# EAGLE design 612_jetracer_esp32c3_030000 (EAGLE 9.6.2)
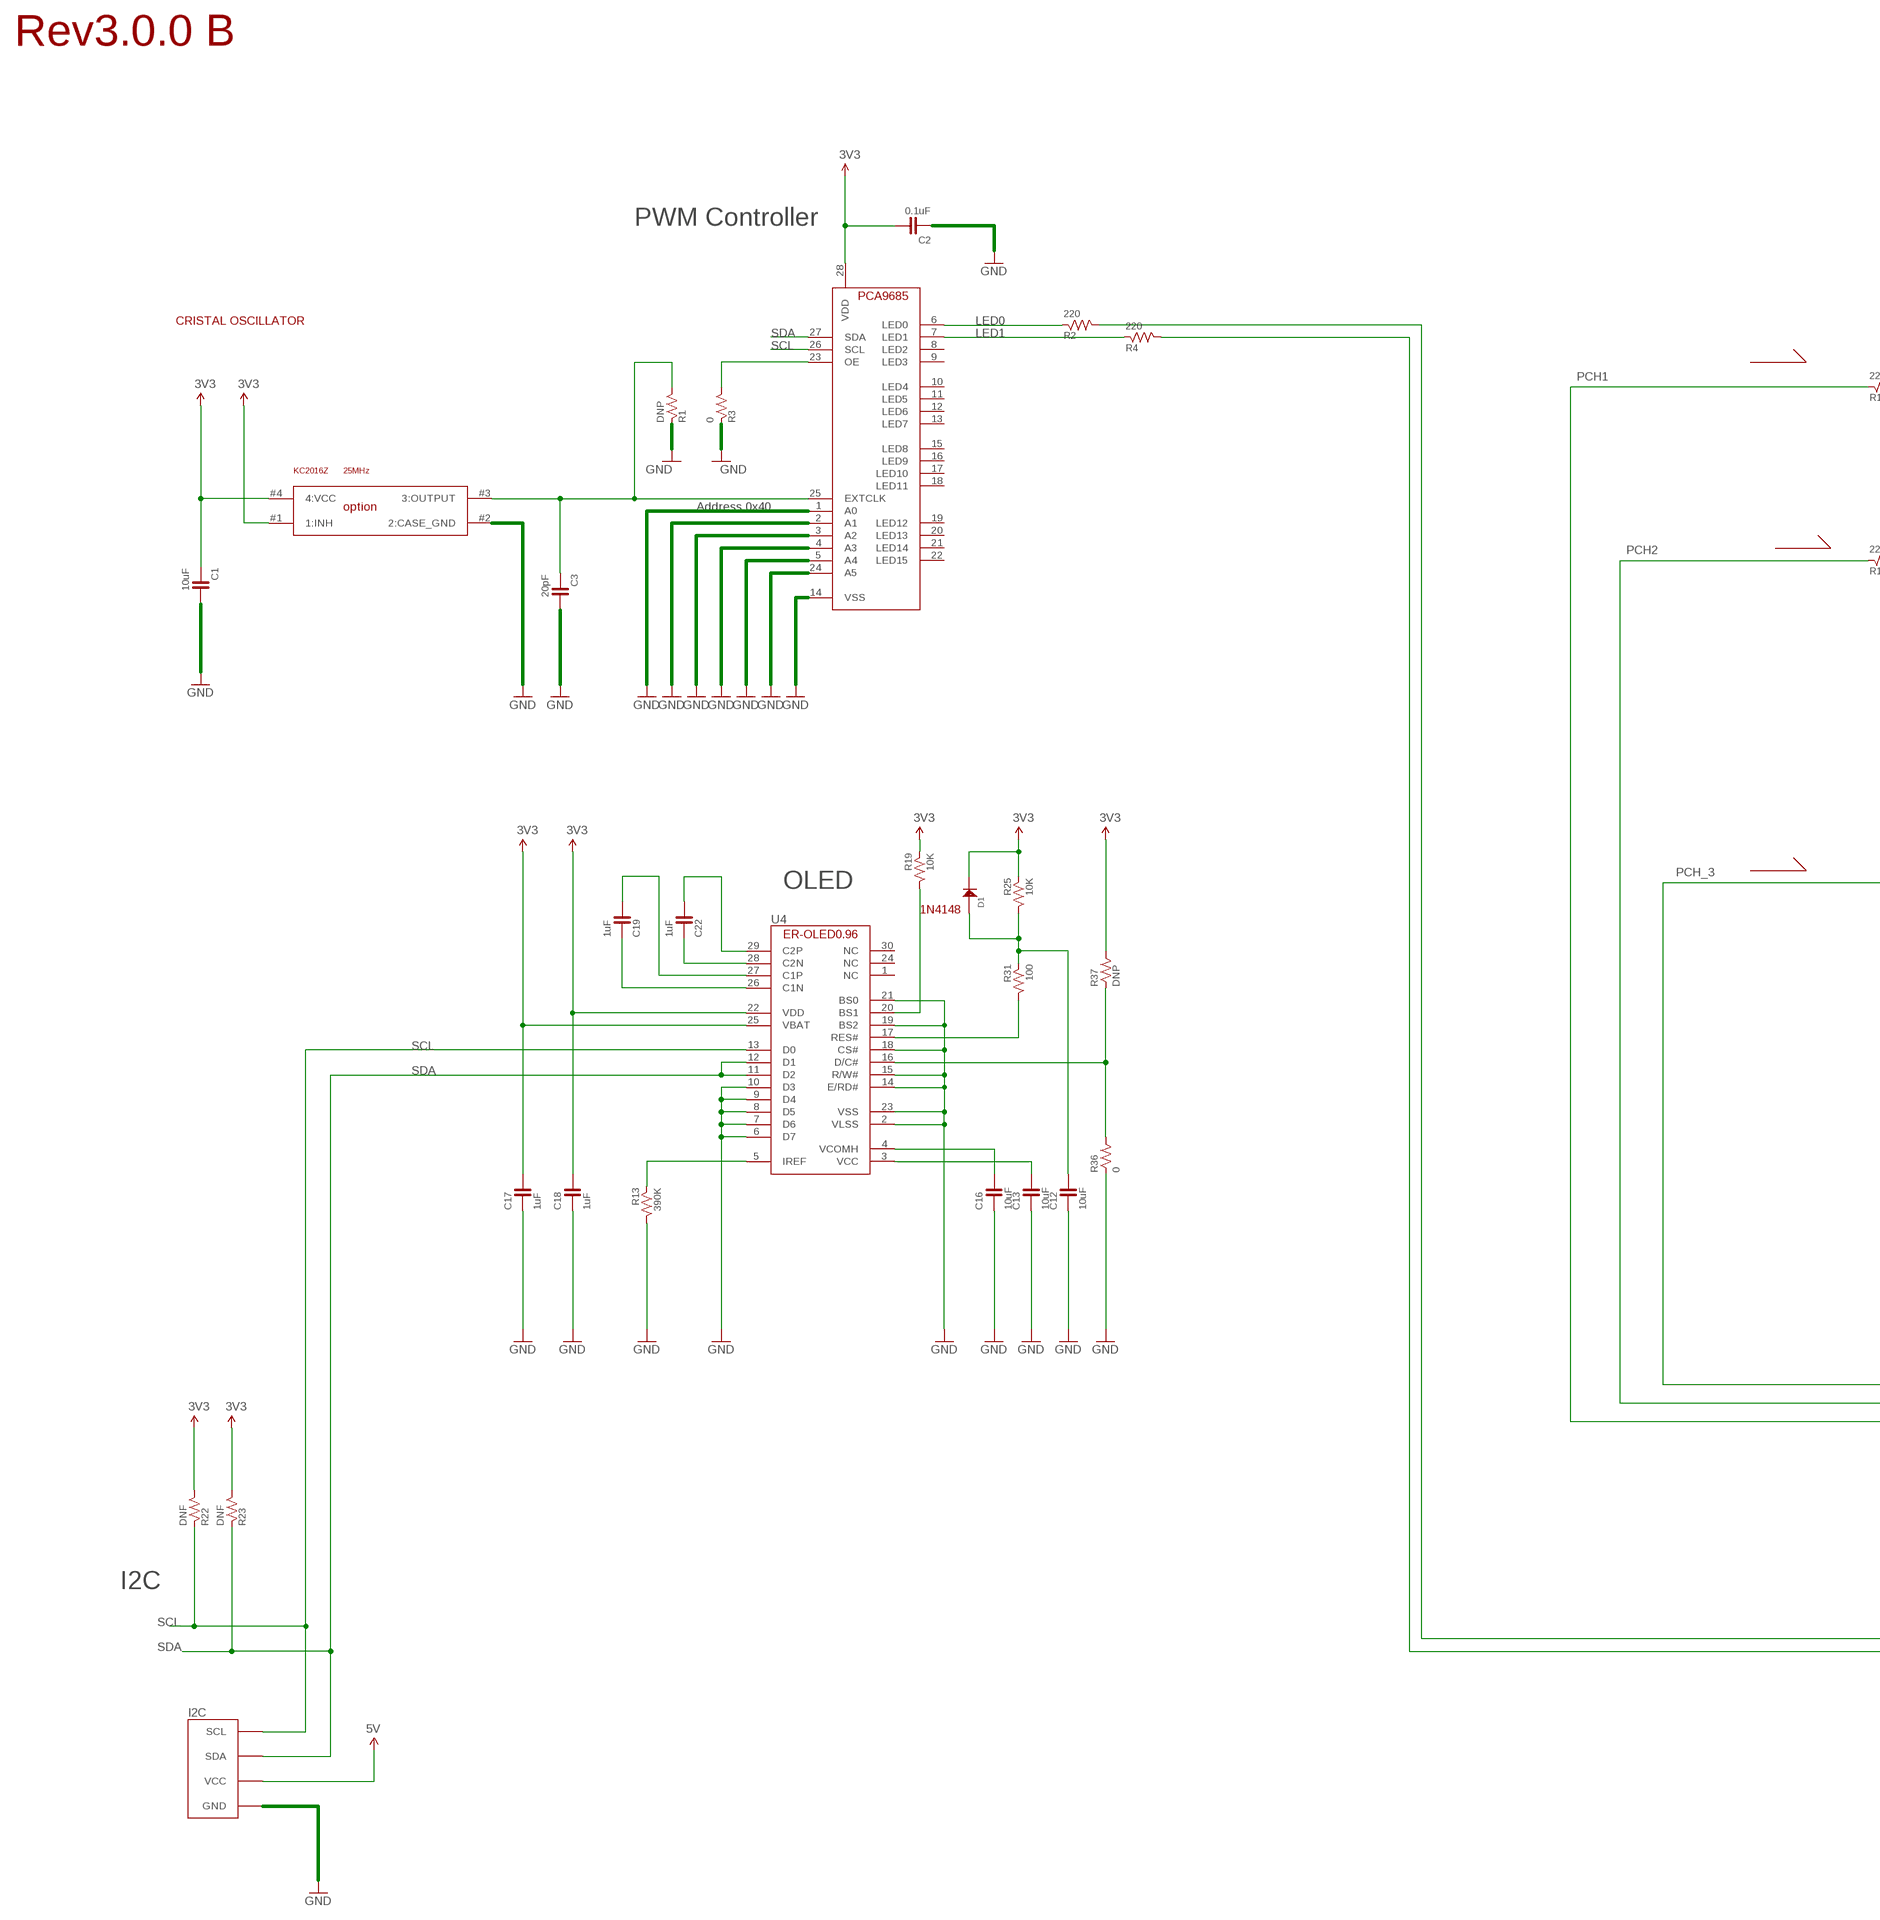
[diagram p0: schematic, sheet 1, part 1 of 3]
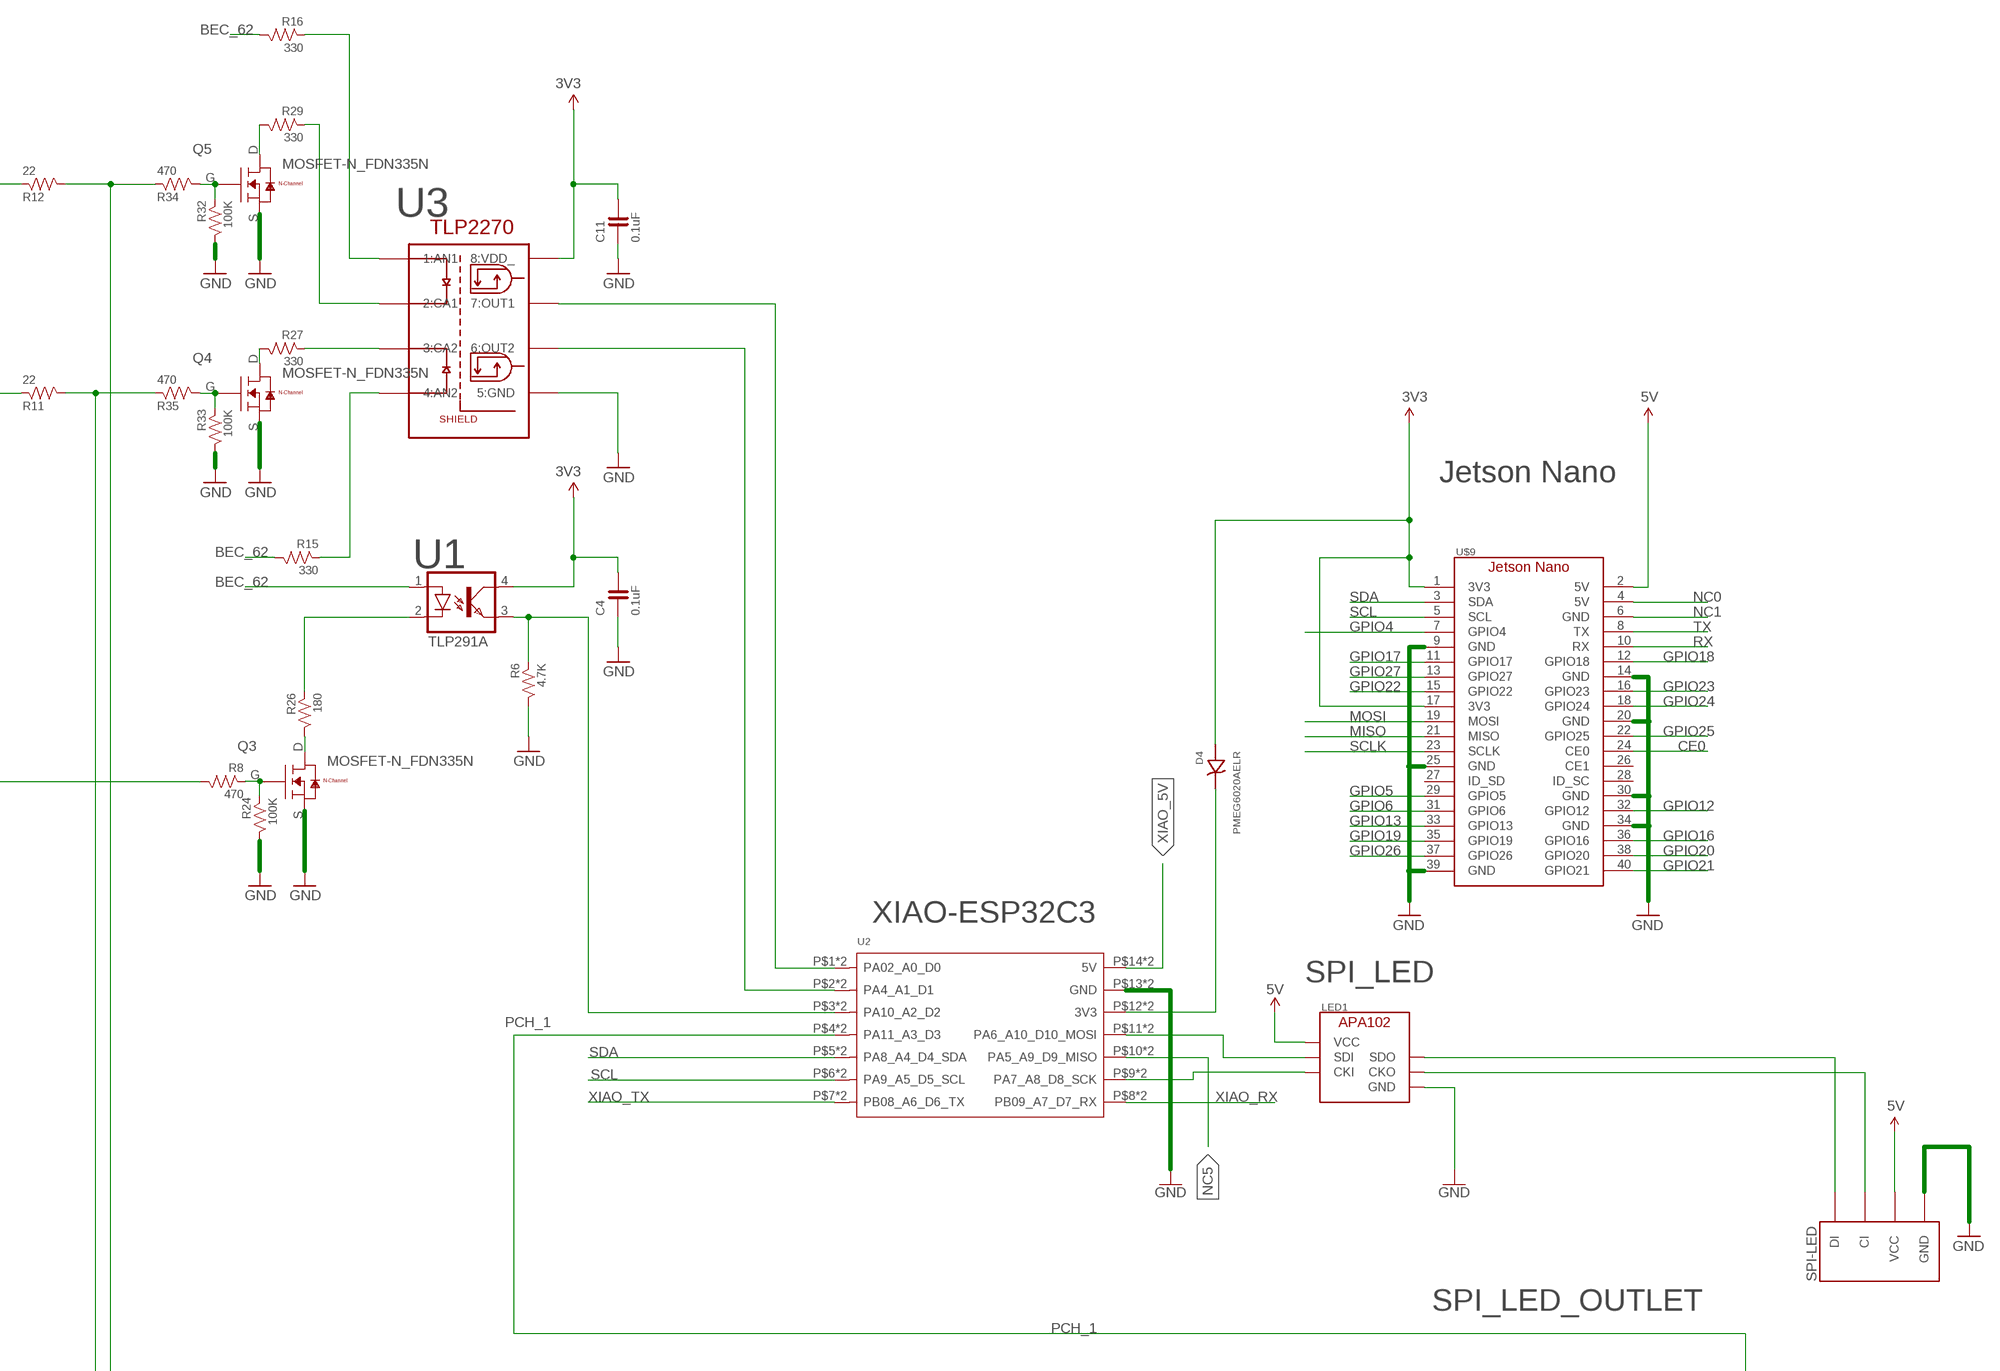
[diagram p1: schematic, sheet 1, part 2 of 3]
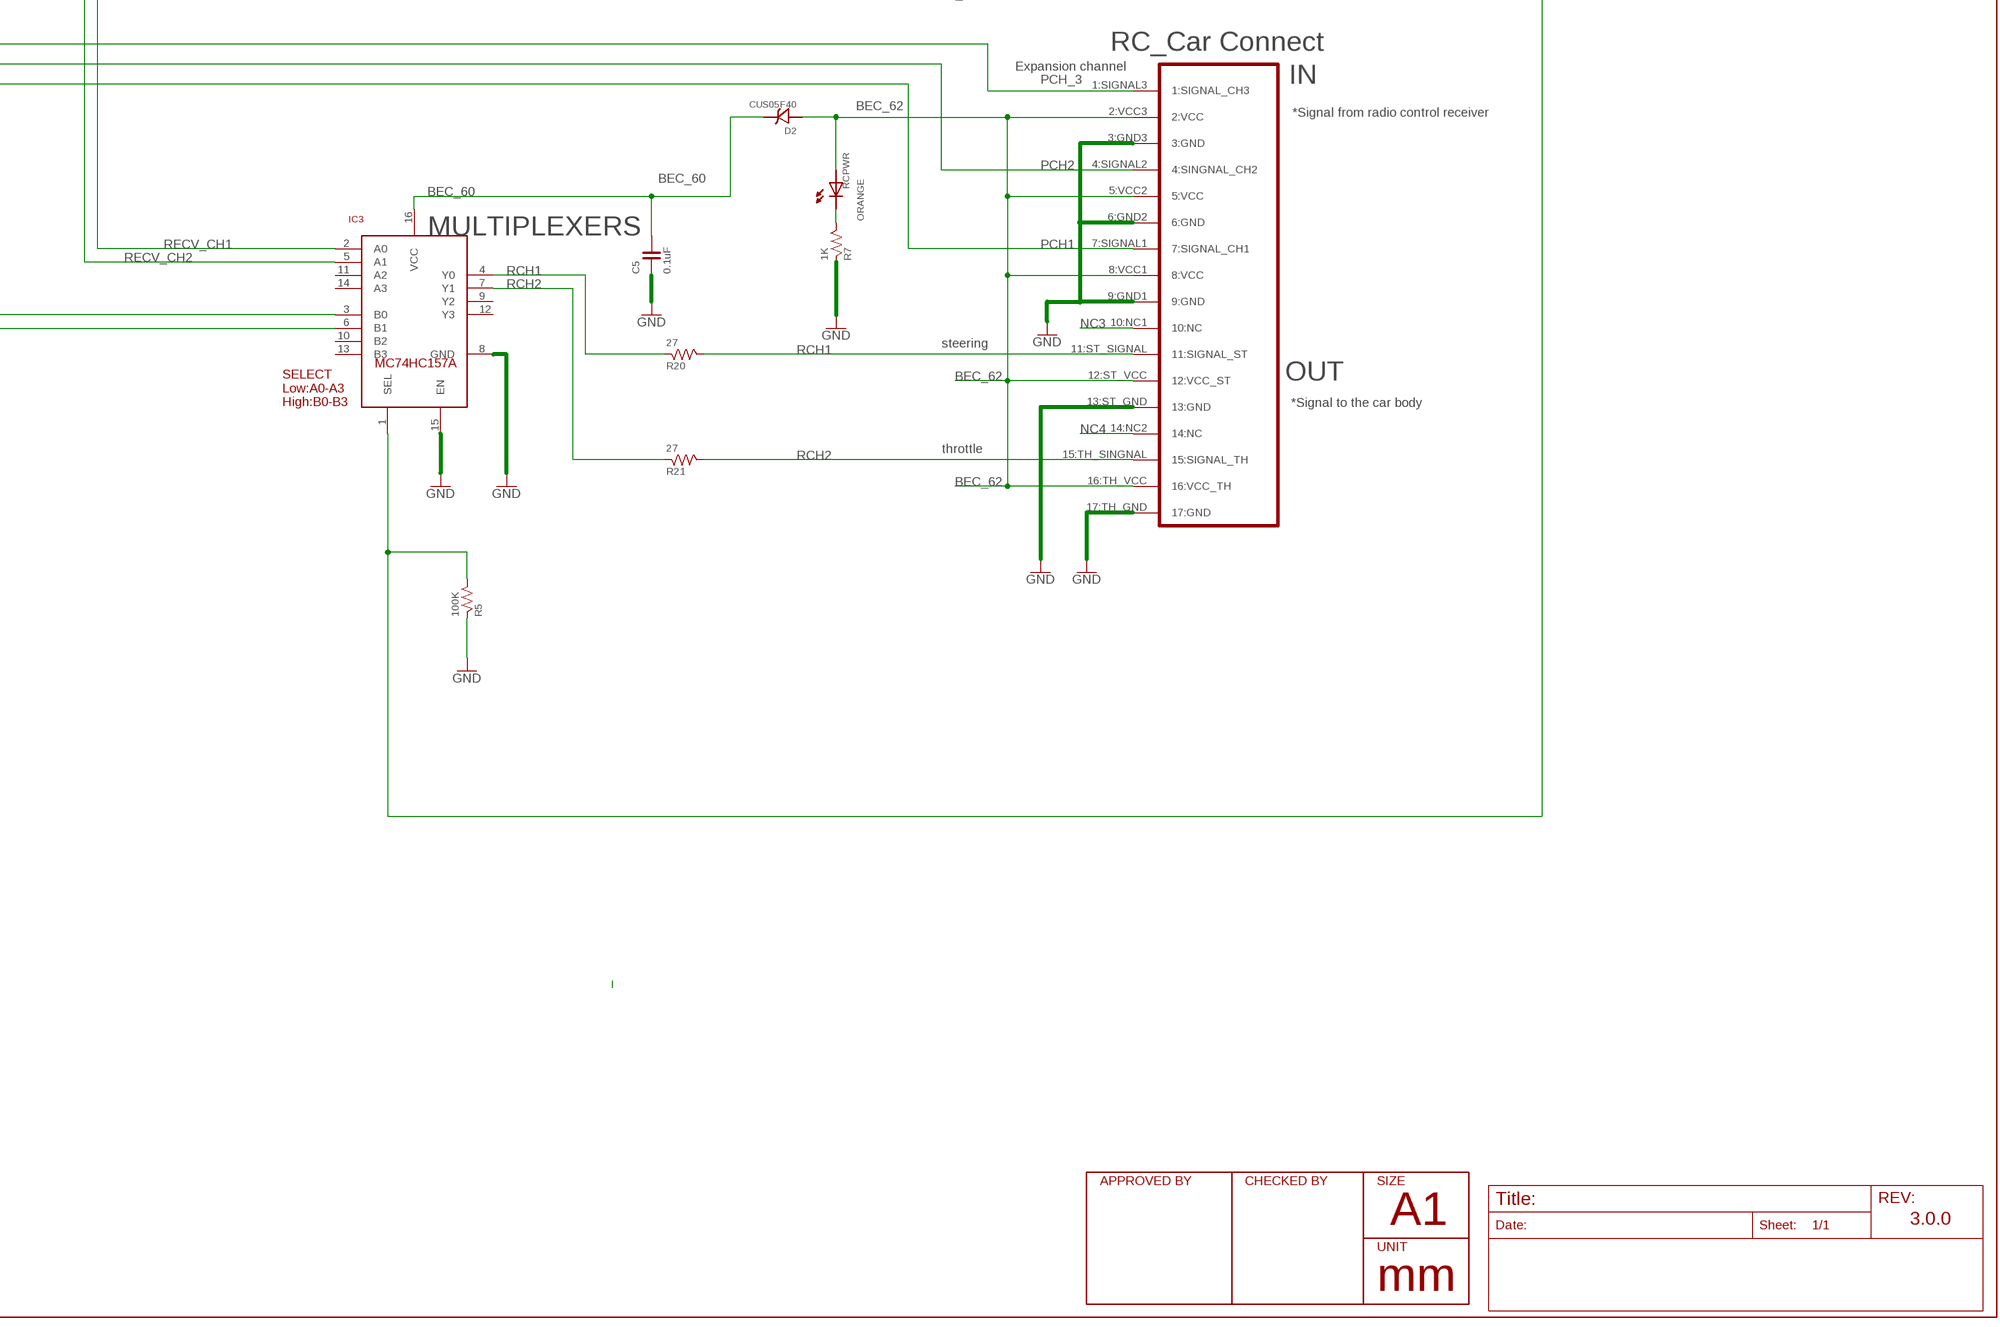
[diagram p2: schematic, sheet 1, part 3 of 3]

## Parts
C1  10uF  CAPACITOR-0603  [0603]
C2  0.1uF  CAPACITOR-0603  [0603]
C3  20pF  CAPACITOR-0603  [0603]
C4  0.1uF  CAPACITOR-0603  [0603]
C5  0.1uF  CAPACITOR-0603  [0603]
C11  0.1uF  CAPACITOR-0603  [0603]
C12  10uF  CAPACITOR-0603  [0603]
C13  10uF  CAPACITOR-0603  [0603]
C16  10uF  CAPACITOR-0603  [0603]
C17  1uF  CAPACITOR-0603  [0603]
C18  1uF  CAPACITOR-0603  [0603]
C19  1uF  CAPACITOR-0603  [0603]
C22  1uF  CAPACITOR-0603  [0603]
D1  1N4148  [1N4148W]
D2  CUS05F40  [CUS05F40]
D4  PMEG6020AELR  [SOD123W]
I2C  FABO-I2C  [I2C-SM04B-PASS-1-FL]
IC3  MULTIPLEXERSMC74HC157A  [TSSOP-16]
IC4  PCA9685_BOTTOM  [PCA9685_BOTTOM]
LED1  APA102_IPIXEL  [APA102_2020]
Q3  MOSFET-N_FDN335N  [SUPERSOT-3]
Q4  MOSFET-N_FDN335N  [SUPERSOT-3]
Q5  MOSFET-N_FDN335N  [SUPERSOT-3]
R1  DNP  RESISTOR-0603  [0603]
R2  220  RESISTOR-0603  [0603]
R3  0  RESISTOR-0603  [0603]
R4  220  RESISTOR-0603  [0603]
R5  100K  RESISTOR-0603  [0603]
R6  4.7K  RESISTOR-0603  [0603]
R7  1K  RESISTOR-0603  [0603]
R8  470  RESISTOR-0603  [0603]
R11  22  RESISTOR-0603  [0603]
R12  22  RESISTOR-0603  [0603]
R13  390K  RESISTOR-0603  [0603]
R15  330  RESISTOR-0603  [0603]
R16  330  RESISTOR-0603  [0603]
R19  10K  RESISTOR-0603  [0603]
R20  27  RESISTOR-0603  [0603]
R21  27  RESISTOR-0603  [0603]
R22  DNF  RESISTOR-0603  [0603]
R23  DNF  RESISTOR-0603  [0603]
R24  100K  RESISTOR-0603  [0603]
R25  10K  RESISTOR-0603  [0603]
R26  180  RESISTOR-0603  [0603]
R27  330  RESISTOR-0603  [0603]
R29  330  RESISTOR-0603  [0603]
R31  100  RESISTOR-0603  [0603]
R32  100K  RESISTOR-0603  [0603]
R33  100K  RESISTOR-0603  [0603]
R34  470  RESISTOR-0603  [0603]
R35  470  RESISTOR-0603  [0603]
R36  0  RESISTOR-0805  [0805]
R37  DNP  RESISTOR-0805  [0805]
RCPWR  ORANGE  LED-0603  [0603]
SPI-LED  FABO-SPI-LED  [SPI-SM04B-PASS-1-FL]
U1  TLP291A  [11-3C1]
U2  MOUDLE-SEEEDUINO-XIAO-ESP32C3  [MOUDLE14P-DIP]
U3  TLP2270  [TLP2270]
U4  ER-OLED0.96-1ER-CON30HT-1  [ER-CON30HT-1]
U$1  RC_17PIN_OUTIN  [PNHEADER_2.54_SMT_17PIN_RC_TT01_02]
U$9  JETSON_NANOJETSON_NANO_OVERALL  [JETSON_NANO_DEMENTION]
U$11  KC2016Z  [KC2016Z]

## Nets
3V3_JETSON: C1.1 C2.2 C4.2 C11.2 C17.2 C18.2 D1.CATHODE D4.2(ANODE) IC4.28(VDD) R19.1 R22.2 R23.2 R25.1 R37.2 U1.4(COL) U3.8(8:VDD_) U4.22(VDD) U4.25(VBAT) U$9.1(3V3) U$9.17(3V3) U$11.#1(1:INH) U$11.#4(4:VCC) ; supply symbol labelled 3V3
5V_JETSON: I2C.5V(VCC) LED1.VCC SPI-LED.5V(VCC) U$9.2(5V) ; supply symbol labelled 5V
BEC_60: C5.2 D2.C(CATHODE) IC3.16(VCC)
BEC_62: D2.A(ANODE) R15.2 R16.2 RCPWR.ANODE U1.1(A) U$1.2:VCC3(2:VCC) U$1.5:VCC2(5:VCC) U$1.8:VCC1(8:VCC) U$1.12:ST_VCC(12:VCC_ST) U$1.16:TH_VCC(16:VCC_TH)
CE0: U$9.24(CE0)
GND: C1.2 C2.1 C3.2 C4.1 C5.1 C11.1 C12.1 C13.1 C16.1 C17.1 C18.1 I2C.GND IC3.8(GND) IC3.15(EN) IC4.1(A0) IC4.2(A1) IC4.3(A2) IC4.4(A3) IC4.5(A4) IC4.14(VSS) IC4.24(A5) LED1.GND Q3.S Q4.S Q5.S R1.1 R3.1 R5.1 R6.2 R7.1 R13.2 R24.2 R32.2 R33.2 R36.1 SPI-LED.GND U2.P$13(GND) U2.P$27(GND) U3.5(5:GND) U4.2(VLSS) U4.6(D7) U4.7(D6) U4.8(D5) U4.9(D4) U4.10(D3) U4.14(E/RD#) U4.15(R/W#) U4.18(CS#) U4.19(BS2) U4.21(BS0) U4.23(VSS) U$1.3:GND3(3:GND) U$1.6:GND2(6:GND) U$1.9:GND1(9:GND) U$1.13:ST_GND(13:GND) U$1.17:TH_GND(17:GND) U$9.9(GND) U$9.14(GND) U$9.20(GND) U$9.25(GND) U$9.30(GND) U$9.34(GND) U$9.39(GND) U$11.#2(2:CASE_GND)
GPIO4: U$9.7(GPIO4)
GPIO5: U$9.29(GPIO5)
GPIO6: U$9.31(GPIO6)
GPIO12: U$9.32(GPIO12)
GPIO13: U$9.33(GPIO13)
GPIO16: U$9.36(GPIO16)
GPIO17: U$9.11(GPIO17)
GPIO18: U$9.12(GPIO18)
GPIO19: U$9.35(GPIO19)
GPIO20: U$9.38(GPIO20)
GPIO21: U$9.40(GPIO21)
GPIO22: U$9.15(GPIO22)
GPIO23: U$9.16(GPIO23)
GPIO24: U$9.18(GPIO24)
GPIO25: U$9.22(GPIO25)
GPIO26: U$9.37(GPIO26)
GPIO27: U$9.13(GPIO27)
LED0: IC4.6(LED0) R2.1
LED1: IC4.7(LED1) R4.1
MISO: U$9.21(MISO)
MOSI: U$9.19(MOSI)
N$2: IC3.6(B1) R4.2
N$3: C22.2 U4.29(C2P)
N$4: IC3.3(B0) R2.2
N$5: U2.P$1(PA02_A0_D0) U2.P$15(PA02_A0_D0) U3.7(7:OUT1)
N$6: R26.1 U1.2(C)
N$7: IC4.23(OE) R3.2
N$8: U2.P$2(PA4_A1_D1) U2.P$16(PA4_A1_D1) U3.6(6:OUT2)
N$9: R15.1 U3.4(4:AN2)
N$10: LED1.SDI U2.P$11(PA6_A10_D10_MOSI) U2.P$25(PA6_A10_D10_MOSI)
N$11: LED1.CKI U2.P$9(PA7_A8_D8_SCK) U2.P$23(PA7_A8_D8_SCK)
N$12: R16.1 U3.1(1:AN1)
N$13: LED1.SDO SPI-LED.DI
N$14: R13.1 U4.5(IREF)
N$15: LED1.CKO SPI-LED.CI
N$16: C19.2 U4.27(C1P)
N$17: C13.2 U4.3(VCC)
N$18: R31.2 U4.17(RES#)
N$21: C19.1 U4.26(C1N)
N$22: C22.1 U4.28(C2N)
N$23: Q3.G R8.1 R24.1
N$24: R7.2 RCPWR.CATHODE
N$25: C16.2 U4.4(VCOMH)
N$26: Q3.D R26.2
N$27: Q4.D R27.2
N$28: R27.1 U3.3(3:CA2)
N$29: Q5.D R29.2
N$30: R29.1 U3.2(2:CA1)
N$32: C12.2 D1.ANODE R25.2 R31.1
N$33: Q5.G R32.1 R34.2
N$34: D4.1(CATHODE) U2.P$12(3V3) U2.P$26(3V3)
N$35: R21.2 U$1.15:TH_SINGNAL(15:SIGNAL_TH)
N$36: R20.2 U$1.11:ST_SIGNAL(11:SIGNAL_ST)
N$37: R36.2 R37.1 U4.16(D/C#)
N$38: Q4.G R33.1 R35.2
N$41: C3.1 IC4.25(EXTCLK) R1.2 U$11.#3(3:OUTPUT)
N$50: R19.2 U4.20(BS1)
NC0: U$9.4(5V)
NC1: U$9.6(GND)
NC3: U$1.10:NC1(10:NC)
NC4: U$1.14:NC2(14:NC)
NC5: U2.P$10(PA5_A9_D9_MISO) U2.P$24(PA5_A9_D9_MISO)
PCH1: R12.1 U$1.7:SIGNAL1(7:SIGNAL_CH1)
PCH2: R11.1 U$1.4:SIGNAL2(4:SINGNAL_CH2)
PCH3_328: R6.1 U1.3(EMI) U2.P$3(PA10_A2_D2) U2.P$17(PA10_A2_D2)
PCH_1: IC3.1(SEL) R5.2 U2.P$4(PA11_A3_D3) U2.P$18(PA11_A3_D3)
PCH_3: R8.2 U$1.1:SIGNAL3(1:SIGNAL_CH3)
RCH1: IC3.4(Y0) R20.1
RCH2: IC3.7(Y1) R21.1
RECV_CH1: IC3.2(A0) R12.2 R34.1
RECV_CH2: IC3.5(A1) R11.2 R35.1
RX: U$9.10(RX)
SCL: I2C.SCL IC4.26(SCL) R22.1 U2.P$6(PA9_A5_D5_SCL) U2.P$20(PA9_A5_D5_SCL) U4.13(D0) U$9.5(SCL)
SCLK: U$9.23(SCLK)
SDA: I2C.SDA IC4.27(SDA) R23.1 U2.P$5(PA8_A4_D4_SDA) U2.P$19(PA8_A4_D4_SDA) U4.11(D2) U4.12(D1) U$9.3(SDA)
TX: U$9.8(TX)
XIAO_5V: U2.P$14(5V) U2.P$28(5V)
XIAO_RX: U2.P$8(PB09_A7_D7_RX) U2.P$22(PB09_A7_D7_RX)
XIAO_TX: U2.P$7(PB08_A6_D6_TX) U2.P$21(PB08_A6_D6_TX)
Unconnected: IC3.9(Y2) IC3.10(B2) IC3.11(A2) IC3.12(Y3) IC3.13(B3) IC3.14(A3) IC4.8(LED2) IC4.9(LED3) IC4.10(LED4) IC4.11(LED5) IC4.12(LED6) IC4.13(LED7) IC4.15(LED8) IC4.16(LED9) IC4.17(LED10) IC4.18(LED11) IC4.19(LED12) IC4.20(LED13) IC4.21(LED14) IC4.22(LED15) U4.1(NC) U4.24(NC) U4.30(NC) U$9.26(CE1) U$9.27(ID_SD) U$9.28(ID_SC)

## Notes on the sheet
- Rev3.0.0 B
- PWM Controller
- CRISTAL OSCILLATOR
- option | Address 0x40
- Jetson Nano
- OLED
- 1N4148
- XIAO-ESP32C3
- SPI_LED
- SPI_LED_OUTLET
- RC_Car Connect
- Expansion channel
- IN
- *Signal from radio control receiver
- MULTIPLEXERS
- I2C
- steering
- MC74HC157A
- OUT
- *Signal to the car body
- SELECT
  Low:A0-A3
  High:B0-B3
- throttle
- 3.0.0

## Library data of the parts
C1-C5 C11-C13 C16-C19 C22 = FaBo-Capacitor:CAPACITOR: CAPACITOR
D1 = FaBo-Diode:1N4148
D2 = FaBo-Diode:CUS05F40
D4 = FaBo-Diode:PMEG6020AELR
I2C = FaBo-Connetor:FABO-I2C
IC3 = FaBo-Multiplexers:MULTIPLEXERS
IC4 = FaBo-Motor:PCA9685
LED1 = FaBo-LED:APA102
Q3-Q5 = FaBo-Mosfet:MOSFET-N
R1-R8 R11-R13 R15 R16 R19-R27 R29 R31-R36 = FaBo-Resistors:RESISTOR: RESISTOR
R37 = FaBo-Resistors:RESISTOR: RESISTOR; SPICEPREFIX: R
RCPWR = FaBo-LED:LED
SPI-LED = FaBo-Connetor:FABO-SPI-LED
U1 = FaBo_Photocoupler:TLP291A
U2 = FaBo-MPU:MOUDLE-SEEEDUINO-XIAO-ESP32C3
U3 = FaBo-Photocoupler:TLP2270
U4 = FaBo-Display:ER-OLED0.96-1
U$1 = FaBo-PIN:RC_17PIN_OUTIN
U$9 = FaBo-Boards:JETSON_NANO
U$11 = FaBo-Crystal:KC2016Z

## Board
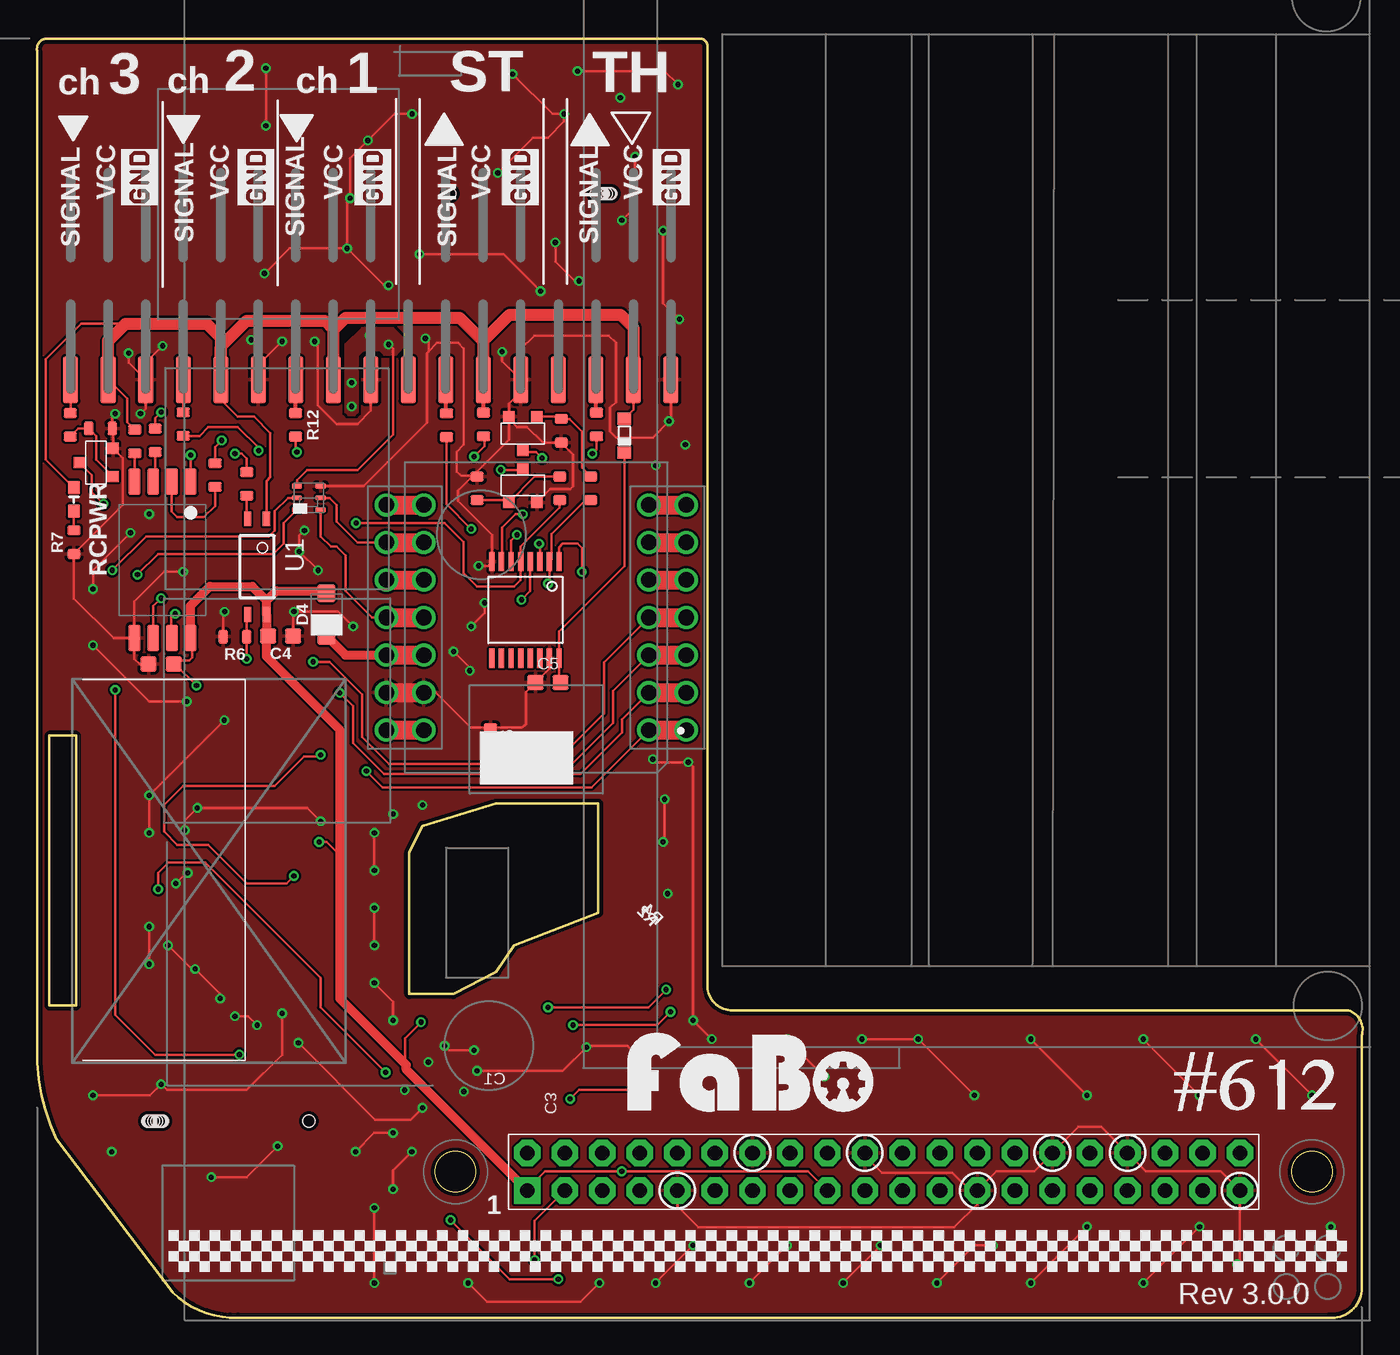
[diagram p3: board, top side]
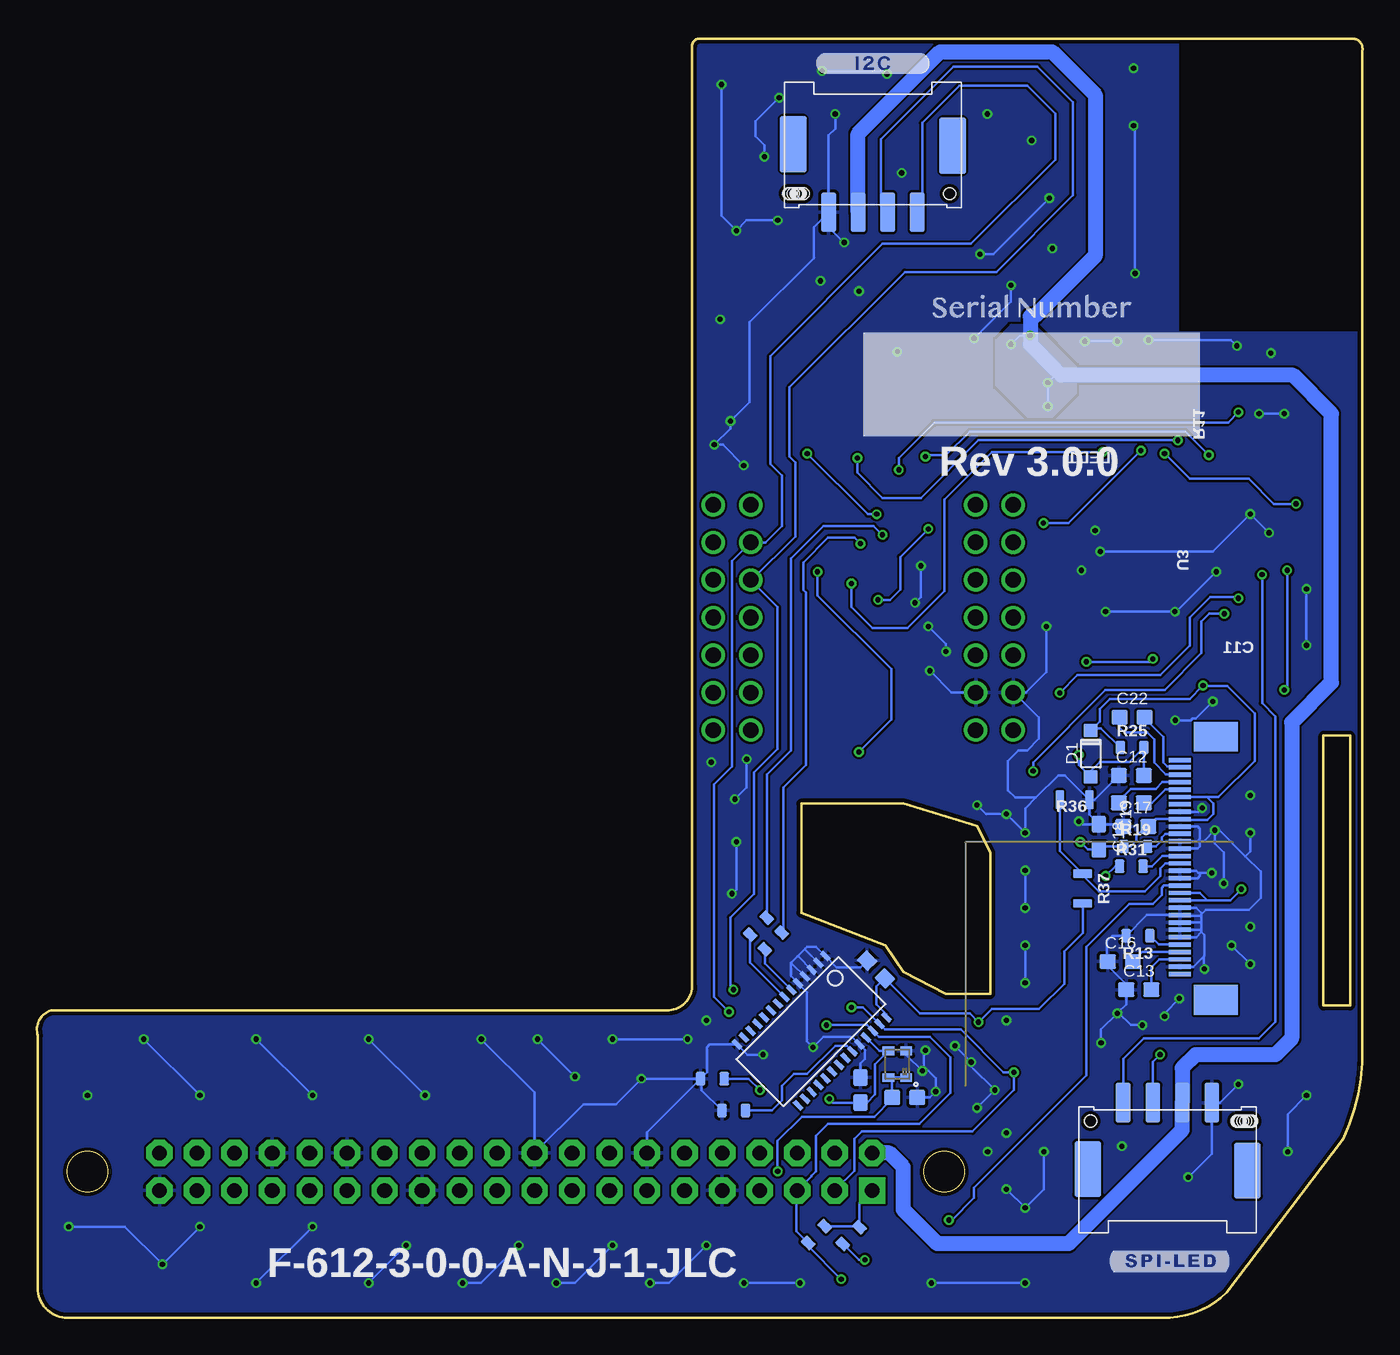
[diagram p4: board, bottom side, seen from below]

Size 89.77 x 86.61 mm. Coordinates in mm from the lower left corner, seen from the top.
Outline: 45.41,22.41 45.41,86.11 arc90 44.91,86.61 0.61,86.61 arc90 0.01,85.81 0.01,18.31 arc26 1.31,12.11 9.21,1.71 arc48 13.61,0.01 87.51,0.01 arc90 89.71,1.81 89.71,19.11 arc90 88.81,20.81 47.11,20.81 arc-90 45.41,22.41
Outline: 0.85,39.41 0.85,21.13 2.66,21.13 2.66,39.41 0.85,39.41
Outline: 25.21,21.91 25.21,31.51 26.11,33.31 31.11,34.81 38.01,34.81 38.01,27.41 32.31,25.21 31.11,23.41 28.21,21.91 25.21,21.91
Copper layers (1*16): Top 0.035mm / dielectric 1.6mm / Bottom 0.035mm
Design rules "PCBway": minimum track width 6mil, minimum drill 12mil, track to track 6mil, track to pad 6mil, pad to pad 6mil, via to via 6mil, smd to smd 6mil, copper to edge 10mil, drill to drill 10mil, minimum pad ring 10mil, minimum via ring 6mil, stop-mask expansion 2mil, vias tented up to drill 100mil, thermal gap 8mil
bRestrict: area -2.3,66.8 to 12.4,89.2

### Footprints (pad centres in the part's own frame; a part is rotated, then mirrored left to right if it is on the bottom)
0603 = smd 1.1 x 1: 1 -0.85,0; 2 0.85,0
1N4148W = smd 0.9 x 0.95: ANODE 0,0; CATHODE 3.15,0
CUS05F40 = smd 0.8 x 0.9: A -1.15,0; C 1.15,0
SOD123W = smd 1.2 x 1.2: 1 -1.45,0; 2 1.45,0
I2C-SM04B-PASS-1-FL = smd 1 x 2.7: 5V -1,0; GND -3,0; SCL 3,0; SDA 1,0 | smd 1.8 x 3.8: P$5 -5.4,4.6; P$6 5.4,4.5 | hole 0.8: 5.2,1.25; -4.7,1.25; -5.7,1.25; -5.6,1.25; -5.4,1.25; -5.2,1.25; -5.1,1.25; -5,1.25; -4.9,1.25
TSSOP-16 = smd 0.36 x 1.3: 1 -2.275,-3.28; 2 -1.625,-3.28; 3 -0.975,-3.28; 4 -0.325,-3.28; 5 0.325,-3.28; 6 0.975,-3.28; 7 1.625,-3.28; 8 2.275,-3.28; 9 2.275,3.28; 10 1.625,3.28; 11 0.975,3.28; 12 0.325,3.28; 13 -0.325,3.28; 14 -0.975,3.28; 15 -1.625,3.28; 16 -2.275,3.28
PCA9685_BOTTOM = smd 0.3 x 0.75 bottom: 1 4.3,-2.93; 2 3.65,-2.93; 3 3,-2.93; 4 2.35,-2.93; 5 1.7,-2.93; 6 1.05,-2.93; 7 0.4,-2.93; 8 -0.25,-2.93; 9 -0.9,-2.93; 10 -1.55,-2.93; 11 -2.2,-2.93; 12 -2.85,-2.93; 13 -3.5,-2.93; 14 -4.15,-2.93; 15 -4.15,2.92; 16 -3.5,2.92; 17 -2.85,2.92; 18 -2.2,2.92; 19 -1.55,2.92; 20 -0.9,2.92; 21 -0.25,2.92; 22 0.4,2.92; 23 1.05,2.92; 24 1.7,2.92; 25 2.35,2.92; 26 3,2.92; 27 3.65,2.92; 28 4.3,2.92
APA102_2020 = smd 0.7 x 0.35: CKI 0.8,0; CKO -0.8,0; GND 0.8,0.8; SDI 0.8,-0.8; SDO -0.8,-0.8; VCC -0.8,0.8
SUPERSOT-3 = smd 0.76 x 0.76: D 0,1.15; G -0.95,-1.15; S 0.95,-1.15
0603' = smd 0.65 x 0.9: 1 -0.8,0; 2 0.8,0
0805 = smd 0.6 x 1.3: 1 -1,0; 2 1,0
0603'' = smd 0.9 x 0.8: ANODE -0.8,0; CATHODE 0.8,0
SPI-SM04B-PASS-1-FL = smd 1 x 2.7: 5V -1,-0.1; CI 1,-0.1; DI 3,-0.1; GND -3,-0.1 | smd 1.8 x 3.8: P$5 -5.4,4.5; P$6 5.4,4.4 | hole 0.8: 5.2,1.15; -4.7,1.15; -5.7,1.15; -4.8,1.15; -4.9,1.15; -5.1,1.15; -5.3,1.15; -5.5,1.15; -5.6,1.15
11-3C1 = smd 1 x 0.5: 1 -3.24,0.635; 2 -3.24,-0.635; 3 3.24,-0.635; 4 3.24,0.635
MOUDLE14P-DIP = drill 1.05: P$1 1.27,18.12; P$2 1.27,15.58; P$3 1.27,13.04; P$4 1.27,10.5; P$5 1.27,7.96; P$6 1.27,5.42; P$7 1.27,2.88; P$8 16.51,2.88; P$9 16.51,5.42; P$10 16.51,7.96; P$11 16.51,10.5; P$12 16.51,13.04; P$13 16.51,15.58; P$14 16.51,18.12; P$15 -1.27,18.12; P$16 -1.27,15.58; P$17 -1.27,13.04; P$18 -1.27,10.5; P$19 -1.27,7.96; P$20 -1.27,5.42; P$21 -1.27,2.88; P$22 19.05,2.88; P$23 19.05,5.42; P$24 19.05,7.96; P$25 19.05,10.5; P$26 19.05,13.04; P$27 19.05,15.58; P$28 19.05,18.12
TLP2270 = smd 0.8 x 1.8: 1 -1.905,-5.3; 2 -0.635,-5.3; 3 0.635,-5.3; 4 1.905,-5.3; 5 1.905,5.3; 6 0.635,5.3; 7 -0.635,5.3; 8 -1.905,5.3
ER-CON30HT-1 = smd 0.3 x 1.5 bottom: 1 7,-0.23; 2 6.5,-0.23; 3 6,-0.23; 4 5.5,-0.23; 5 5,-0.23; 6 4.5,-0.23; 7 4,-0.23; 8 3.5,-0.23; 9 3,-0.23; 10 2.5,-0.23; 11 2,-0.23; 12 1.5,-0.23; 13 1,-0.23; 14 0.5,-0.23; 15 0,-0.23; 16 -0.5,-0.23; 17 -1,-0.23; 18 -1.5,-0.23; 19 -2,-0.23; 20 -2.5,-0.23; 21 -3,-0.23; 22 -3.5,-0.23; 23 -4,-0.23; 24 -4.5,-0.23; 25 -5,-0.23; 26 -5.5,-0.23; 27 -6,-0.23; 28 -6.5,-0.23; 29 -7,-0.23; 30 -7.5,-0.23 | smd 2 x 3 bottom: 31 -9.07,-2.67; 32 8.74,-2.67
PNHEADER_2.54_SMT_17PIN_RC_TT01_02 = smd 1.02 x 3.17: 1:SIGNAL3 -20.32,0; 2:VCC3 -17.78,0; 3:GND3 -15.24,0; 4:SIGNAL2 -12.7,0; 5:VCC2 -10.16,0; 6:GND2 -7.62,0; 7:SIGNAL1 -5.08,0; 8:VCC1 -2.54,0; 9:GND1 0,0; 10:NC1 2.54,0; 11:ST_SIGNAL 5.08,0; 12:ST_VCC 7.62,0; 13:ST_GND 10.16,0; 14:NC2 12.7,0; 15:TH_SINGNAL 15.24,0; 16:TH_VCC 17.78,0; 17:TH_GND 20.32,0
JETSON_NANO_DEMENTION = drill 1 pad 1.778 square: 1 0,0 | drill 1 pad 1.778 octagon: 2 0,2.54; 3 2.54,0; 4 2.54,2.54; 5 5.08,0; 6 5.08,2.54; 7 7.62,0; 8 7.62,2.54; 9 10.16,0; 10 10.16,2.54; 11 12.7,0; 12 12.7,2.54; 13 15.24,0; 14 15.24,2.54; 15 17.78,0; 16 17.78,2.54; 17 20.32,0; 18 20.32,2.54; 19 22.86,0; 20 22.86,2.54; 21 25.4,0; 22 25.4,2.54; 23 27.94,0; 24 27.94,2.54; 25 30.48,0; 26 30.48,2.54; 27 33.02,0; 28 33.02,2.54; 29 35.56,0; 30 35.56,2.54; 31 38.1,0; 32 38.1,2.54; 33 40.64,0; 34 40.64,2.54; 35 43.18,0; 36 43.18,2.54; 37 45.72,0; 38 45.72,2.54; 39 48.26,0; 40 48.26,2.54
KC2016Z = smd 0.6 x 0.8: #1 -0.9,-0.6; #2 0.9,-0.6; #3 0.9,0.6; #4 -0.9,0.6

### Placement (x,y rotation side)
C1  31.01,14.91 0 bottom
C2  32.95,23.57 315 bottom
C3  34.01,15.41 90 bottom
C4  16.51,46.16 180 top
C5  34.61,43.01 0 top
C11  8.41,44.26 0 top
C12  15.66,36.71 0 bottom
C13  15.16,22.21 0 bottom
C16  16.41,24.11 0 bottom
C17  15.36,33.26 0 bottom
C18  17.86,32.56 270 bottom
C19  15.66,34.86 180 bottom
C22  15.61,40.66 0 bottom
D1  18.41,36.61 90 bottom
D2  39.78,59.73 270 top
D4  19.61,47.61 90 top
I2C  33.16,74.86 0 bottom
IC3  33.08,47.93 180 top
IC4  37.35,19.37 135 top
LED1  18.41,55.51 0 top
Q3  4.01,57.91 90 top
Q4  32.91,56.36 0 top
Q5  32.91,59.86 180 top
R1  DNP  [0603']  44.03,16.18 0 bottom
R2  220  [0603']  39.91,25.51 45 bottom
R3  0  [0603']  42.58,14.03 0 bottom
R4  220  [0603']  40.91,26.51 45 bottom
R5  100K  [0603']  30.71,39.11 270 top
R6  4.7K  [0603']  13.41,46.11 180 top
R7  1K  [0603']  2.51,52.51 90 top
R8  470  [0603']  2.26,60.46 90 top
R11  22  [0603']  9.91,60.51 270 top
R12  22  [0603']  17.51,60.46 270 top
R13  390K  [0603']  15.21,25.86 180 bottom
R15  330  [0603']  6.63,59.33 90 top
R16  330  [0603']  30.23,60.48 90 top
R19  10K  [0603']  15.36,31.91 0 bottom
R20  27  [0603']  27.73,60.43 90 top
R21  27  [0603']  37.88,60.48 90 top
R22  DNF  [0603']  36.98,5.63 45 bottom
R23  DNF  [0603']  34.64,5.56 45 bottom
R24  100K  [0603']  4.31,60.21 0 top
R25  10K  [0603']  15.61,38.61 0 bottom
R26  180  [0603']  14.21,56.46 90 top
R27  330  [0603']  8.01,59.41 90 top
R29  330  [0603']  12.06,57.06 90 top
R31  100  [0603']  15.66,30.56 0 bottom
R32  100K  [0603']  35.51,60.06 270 top
R33  100K  [0603']  29.81,56.16 90 top
R34  470  [0603']  37.51,56.16 90 top
R35  470  [0603']  35.41,56.16 90 top
R36  19.51,35.06 180 bottom
R37  18.96,29.06 270 bottom
RCPWR  ORANGE  [0603'']  2.51,55.41 270 top
SPI-LED  13.21,14.46 180 bottom
U1  14.91,50.86 270 top
U2  42.71,57.91 180 top
U3  8.51,51.31 180 top
U4  12.61,30.26 270 top
U$1  22.61,63.51 0 top
U$2  [LOGO_FABO_L]  47.61,13.96 0 top
U$5  [LOGO_SILK_GND]  16.11,75.31 90 top
U$6  [LOGO_SILK_GND]  24.01,75.31 90 top
U$7  [LOGO_SILK_GND]  34.01,75.31 90 top
U$8  [LOGO_SILK_GND]  44.21,75.31 90 top
U$9  33.21,8.61 0 top
U$11  31.51,17.16 90 bottom
U$12  [LOGO_SILK_GND]  8.21,75.31 90 top

### Tracks (layer width: path | path; a pad name or v marks a point on that pad's centre or on a via)
3V3_JETSON  (via drill 0.35)
  Top 0.152: C4.2 15.54,46.27 | U$9.17 52.23,9.91 v39.61,9.91 34.41,9.91 33.21,8.71 U$9.1 | v26.01,20.01 24.92,18.93 24.92,17.11 25.01,17.11 | C11.2 9.31,44.31 | 9.31,44.31 9.51,44.51 10.31,44.51 10.51,44.71 10.51,45.91 U3.8 | v19.11,32.21 19.62,32.21 20.52,31.31 | v10.81,42.81 9.31,44.31
  Top 0.61: U$9.1 25.01,16.81 25.01,17.11 20.52,21.59 20.52,31.31 20.52,39.79 15.54,44.77 15.54,46.27 U1.4 15.54,48.54 | 15.54,48.54 16.21,49.21 19.46,49.21 D4.2 | U3.8 10.41,48.21 11.71,49.51 14.58,49.51 15.54,48.54
  Bottom 0.152: U$9.1 34.07,7.75 R23.2 34.14,6.2 R22.2 | U$11.#1 U$11.#4 31.86,16.01 C1.1 31.86,14.81 33.06,13.61 37.96,13.61 39.61,11.96 v39.61,9.91 | IC4.28 32.25,20.55 32.91,21.21 32.91,22.42 C2.2 29.99,20.61 26.61,20.61 v26.01,20.01 25.11,20.91 21.91,20.91 20.21,22.61 20.21,24.81 18.96,26.06 R37.2 | U4.25 10.56,35.26 | 10.56,35.26 10.11,34.81 10.11,34.11 10.51,33.71 12.33,33.71 U4.22 14.01,33.76 C17.2 14.66,33.26 15.31,32.61 15.31,32.31 15.71,31.91 R19.1 17.66,31.91 C18.2 18.61,31.71 v19.11,32.21 | R25.1 17.71,39.91 18.26,39.91 D1.CATHODE 17.81,40.36 17.81,41.21 17.11,41.91 11.71,41.91 10.86,42.76 | 10.86,42.76 v10.81,42.81 | 10.56,35.26 9.76,35.26 7.31,37.71 7.31,40.91 9.16,42.76 10.86,42.76
5V_JETSON  (via drill 0.35)
  Top 0.152: LED1.VCC 17.61,56.71 18.31,57.41 21.71,57.41 24.11,59.81 24.11,65.61 v23.81,65.91
  Bottom 0.152: 29.81,6.01 30.11,6.31 | v22.51,66.51 23.21,66.51 v23.81,65.91 | v21.31,61.71 v21.31,63.31 20.81,63.81 20.81,64.21
  Bottom 1.016: I2C.5V 34.16,80.16 28.61,85.71 21.01,85.71 18.11,82.81 18.11,71.91 22.21,67.81 22.51,67.81 v22.51,66.51 22.51,65.91 20.81,64.21 20.41,63.81 4.71,63.81 2.11,61.21 2.11,43.01 4.81,40.31 4.81,18.91 5.91,17.81 11.31,17.81 12.21,16.91 SPI-LED.5V 12.21,12.71 19.91,5.01 28.81,5.01 30.11,6.31 31.11,7.31 31.11,10.21 32.05,11.15 U$9.2
  pour Bottom (no thermals): 19.41,62.61 19.41,64.41 22.21,67.21 23.81,67.21 24.81,66.21 24.81,63.11 22.71,61.01 21.01,61.01
  pour Top (no thermals): 20.91,65.91 20.91,61.31 21.11,61.11 21.51,61.11 21.71,61.31 21.71,65.11 22.11,65.51 23.21,65.51 23.51,65.21 24.31,65.21 25.01,65.91 25.01,66.11 24.11,67.01 22.01,67.01
BEC_60
  Top 0.152: D2.C 39.78,50.88 35.36,46.46 IC3.16 35.36,43.11 C5.2
BEC_62
  Top 0.152: R16.2 30.21,61.3 | U$1.16:TH_VCC 40.39,61.48 D2.A | R15.2 6.11,60.65 6.11,62.23 U$1.2:VCC3 | U1.1 15.54,56.64 15.81,56.91 15.81,59.91 14.71,61.01 13.61,61.01 12.45,62.17 U$1.5:VCC2 | RCPWR.ANODE 0.61,58.11 0.61,64.91 3.01,67.31 6.31,67.31
  Top 0.254: R16.2 U$1.12:ST_VCC
  Top 0.813: U$1.2:VCC3 4.83,66.13 6.01,67.31 6.31,67.31 11.51,67.31 12.45,66.37 U$1.5:VCC2 12.45,65.75 14.21,67.51 19.51,67.51 20.11,66.91 | 20.11,66.91 20.11,63.55 U$1.8:VCC1 | 20.11,66.91 20.91,67.71 28.61,67.71 30.21,66.11 | U$1.12:ST_VCC 30.21,63.53 30.21,66.11 | 30.21,66.11 32.01,67.91 39.51,67.91 40.39,67.03 U$1.16:TH_VCC
GND  (via drill 0.35)
  Top 0.152: 29.81,57.01 R33.2 29.46,56.96 28.51,56.01 28.51,55.31 30.81,53.01 IC3.8 30.51,50.91 v29.91,50.91 | 29.81,57.01 29.81,57.31 31.96,59.46 31.96,60.86 | 31.96,60.86 Q5.S 31.96,61.91 32.66,62.61 32.66,63.4 U$1.13:ST_GND | 31.96,60.86 32.51,60.31 33.21,60.31 34.26,59.26 R32.2 36.31,58.46 36.31,56.31 36.11,56.11 34.76,56.11 Q4.S | IC3.15 34.71,43.96 C5.1 33.11,42.36 33.11,40.21 32.86,39.96 30.76,39.96 R5.1 30.66,39.96 29.36,39.96 26.99,42.33 U2.P$13 | U$1.3:GND3 7.37,64.67 v8.51,65.81 | v14.51,66.21 14.99,65.73 U$1.6:GND2 14.99,64.49 v16.61,66.11 | v5.31,61.21 5.11,61.01 R24.2 5.16,60.16 Q3.S 5.81,58.21 5.81,55.01 R7.1 2.51,48.71 5.21,46.01 U3.5 | v7.01,61.21 7.37,61.57 U$1.3:GND3 | U$1.3:GND3 6.21,64.67 v6.21,65.31 | v18.81,66.11 19.01,65.91 19.01,61.81 20.31,60.51 21.71,60.51 22.61,61.41 U$1.9:GND1 | v29.81,16.71 35.61,16.71 v37.21,18.31 37.31,18.41 39.99,18.41 v40.59,17.81 | C4.1 17.36,47.76 v17.41,47.81 20.41,47.81 v21.41,46.81 | v12.71,47.81 12.61,47.71 R6.2 | U3.5 6.6,48.5 8.61,50.51 v9.91,50.51 | U$9.9 43.37,7.55 44.81,6.11 62.11,6.11 63.69,7.69 U$9.25 | U$9.25 63.21,8.61 62.01,9.81 57.21,9.81 56.07,10.95 U$9.20 | U$9.25 64.99,9.91 67.53,9.91 U$9.30 70.53,12.91 72.09,12.91 U$9.34 75.09,9.91 80.17,9.91 U$9.39 81.47,3.82 v81.27,3.62 | v30.31,48.41 30.31,47.71 v29.41,46.81 | v28.21,45.11 29.31,44.01 v29.31,43.81 | LED1.GND 22.11,56.31 26.41,60.61 26.41,65.31 26.51,65.41 | 26.51,65.41 27.11,66.01 28.51,66.01 28.91,65.61 28.91,59.11 28.41,58.61 28.41,57.31 28.71,57.01 29.81,57.01 | U$1.17:TH_GND 42.93,60.83 v42.81,60.71 41.71,59.61 39.21,59.61 38.81,60.01 38.81,61.61 39.21,62.01 39.21,66.01 38.71,66.51 33.71,66.51 32.77,65.57 U$1.13:ST_GND
  Top 0.152: U3.5 6.6,44.61 6.96,44.26 C11.1 | 49.01,16.01 v48.84,16.18 | v16.61,20.61 16.61,17.81 14.21,15.41 8.81,15.41 v8.41,15.81 7.65,15.05 v3.8,15.05 | v17.71,18.61 22.91,13.41 25.31,13.41 v26.11,14.21 | v10.01,33.01 10.01,33.65 v10.86,34.51 18.31,34.51 v19.21,33.61 | v10.21,30.11 10.11,30.11 v9.41,29.41 | v12.41,21.61 12.41,21.91 v10.71,23.61 10.48,23.61 v8.88,25.21 | v13.41,20.41 14.31,20.41 v14.91,19.81 | v29.61,18.11 27.91,18.11 v27.61,18.41 | v11.81,9.51 14.21,9.51 v16.31,11.61 | v78.73,6.16 v74.92,2.35 | v71.11,6.16 v67.3,2.35 | v64.76,4.89 63.49,4.89 v60.95,2.35 | v57.14,4.89 v54.6,2.35 | v50.79,4.89 v48.25,2.35 | v44.44,4.89 v41.9,2.35 | v38.09,2.35 36.82,1.08 30.47,1.08 v29.2,2.35 | v22.85,2.35 v22.85,7.43 | v21.58,11.24 22.85,12.51 v24.12,12.51 | v7.61,32.83 v7.61,35.37 v12.69,40.45 | v10.15,41.72 7.61,41.72 v3.8,45.53 | v3.8,49.34 3.8,50.61 v6.34,53.15 | v19.04,50.61 v17.77,51.88 17.77,52.97 v18.11,53.31 | v22.85,32.83 v22.85,30.29 | v22.85,27.75 v22.85,25.21 | v22.85,22.67 24.12,21.4 v24.12,20.13 | v24.12,8.7 24.12,9.97 v25.39,11.24 | v63.49,15.05 v59.68,18.86 v55.87,18.86 | v67.3,18.86 v71.11,15.05 | v74.92,18.86 v78.73,15.05 | v82.54,18.86 v86.35,15.05 | v7.61,23.94 v7.61,26.48 | v53.33,16.32 v50.79,18.86 | v45.71,18.86 v44.44,20.13 44.44,37.28 v44.11,37.61 41.91,37.61 v41.71,37.81 | U$1.13:ST_GND 31.51,64.77 v31.51,65.41 | 26.51,65.41 26.51,66.11 v26.31,66.31 | v23.81,69.91 23.51,69.91 v21.01,72.41 | v21.01,72.41 21.01,75.61 v21.21,75.81 21.21,78.51 v22.41,79.71 24.21,81.51 v25.41,81.51 | v25.91,72.01 31.61,72.01 v34.11,69.51 | v36.71,70.21 36.41,70.21 35.11,71.51 v35.11,72.81 | v32.21,84.21 34.91,81.51 v35.71,81.51 35.71,81.01 34.61,79.91 33.61,79.91 v31.21,77.51
  Top 0.152: v36.61,84.41 42.51,84.41 v43.41,83.51 | v42.41,73.61 42.41,68.71 v43.51,67.61 | v40.51,78.61 40.51,75.21 v39.61,74.31 | v21.01,72.41 17.11,72.41 v15.41,70.71 | v15.51,80.71 v15.51,84.61 | v42.51,35.11 42.51,32.31 v42.41,32.21
  Top 1.27: U2.P$27 U2.P$13
  Bottom 0.152: v8.51,65.81 8.91,66.21 v14.51,66.21 | v5.31,61.21 v7.01,61.21 | v16.61,66.11 v18.81,66.11 | R1.1 44.75,16.26 | 44.75,16.26 44.41,16.6 44.41,18.31 44.21,18.51 IC4.14 41.66,17.81 v40.59,17.81 | U$9.14 48.45,12.56 R1.1 | v29.81,16.71 30.91,17.81 U$11.#2 | v17.41,47.81 v12.71,47.81 12.61,47.81 v9.91,50.51 | R1.1 v48.84,16.18 50.57,14.45 52.77,14.45 U$9.20 56.07,15.25 v59.68,18.86 | 37.76,24.96 37.61,25.11 37.01,25.11 IC4.1 35.61,23.71 34.02,23.71 C2.1 | 37.76,24.96 38.26,24.46 | 38.26,24.46 38.66,24.06 | 38.66,24.06 38.71,24.01 38.71,23.13 IC4.5 37.61,22.03 37.61,18.71 v37.21,18.31 36.51,19.01 34.59,19.01 IC4.24 33.71,18.13 33.71,17.51 34.01,17.21 C3.2 | IC4.4 38.66,24 38.66,24.06 | IC4.3 38.2,24.46 38.26,24.46 | IC4.2 37.76,24.94 37.76,24.96 | v21.41,46.81 21.41,43.71 22.79,42.33 23.61,42.33 | 23.61,42.33 U2.P$27 | v29.91,50.91 29.91,48.81 v30.31,48.41 | v29.41,46.81 28.21,45.61 v28.21,45.11 | v29.31,43.81 27.83,42.33 U2.P$13 | I2C.GND 37.16,73.86 37.16,71.76 41.51,67.41 41.51,62.01 v42.81,60.71 42.81,60.21 v43.91,59.11 43.31,59.11 v41.91,57.71 | R36.1 18.51,34.06 C18.1 | R36.1 18.16,35.06 C12.1 | 15.96,25.81 R13.2 | R13.2 14.61,27.26 U4.9 12.33,27.21 10.91,27.21 | U4.10 11.26,27.76 10.91,27.41 10.91,27.31 | 10.91,27.31 10.91,27.21 | 10.91,27.21 10.91,26.81 | 10.91,26.81 10.91,26.31 | 10.91,26.31 10.91,26.11 | 10.91,26.11 11.26,25.76 U4.6 | U4.7 10.96,26.26 10.91,26.31 | U4.8 10.96,26.76 10.91,26.81 | U4.2 11.46,23.76 10.76,24.46 | 10.76,24.46 10.71,24.51 10.71,25.91 10.91,26.11 | 16.56,20.66 16.01,21.21 C13.1 16.01,22.56 17.26,23.81 C16.1 17.31,24.16 17.31,25.51 16.96,25.86 R13.2 | 16.56,20.66 v16.61,20.61 17.71,19.51 v17.71,18.61
  Bottom 0.152: U4.14 11.16,29.76 11.01,29.91 11.01,30.01 11.11,30.11 | U4.15 11.26,30.26 11.11,30.11 | U4.18 11.16,31.76 11.01,31.91 11.01,32.11 11.16,32.26 | 11.16,32.26 U4.19 | U4.21 11.16,33.26 11.01,33.11 11.01,32.41 11.16,32.26 | U4.23 11.11,34.26 v10.86,34.51 | v10.01,33.01 10.76,32.26 11.16,32.26 | R36.1 20.16,36.71 20.61,36.71 22.11,35.21 | 22.11,35.21 23.51,35.21 24.01,35.71 24.01,37.71 23.31,38.41 22.71,38.41 21.91,39.21 21.91,40.63 23.61,42.33 | 10.91,27.31 10.61,27.61 7.71,27.61 6.91,28.41 6.91,30.21 7.93,31.23 | 7.93,31.23 9.71,33.01 v10.01,33.01 | 11.11,30.11 v10.21,30.11 | v9.41,29.41 9.41,31.51 10.01,32.11 v10.01,33.01 | 10.76,24.46 10.76,23.66 v10.71,23.61 | v12.41,21.61 13.41,20.61 v13.41,20.41 | v14.91,19.81 15.71,19.81 16.56,20.66 | C17.1 16.36,33.41 C18.1 | C18.1 19.01,33.41 v19.21,33.61 | v26.11,14.21 v24.91,15.41 26.51,17.01 v26.51,17.31 v27.61,18.41 | v29.61,18.11 29.71,18.01 29.71,16.91 29.81,16.81 v29.81,16.71 | C1.2 29.31,14.91 v28.91,15.31 28.91,16.21 29.41,16.71 v29.81,16.71 | v8.41,15.81 9.66,14.56 SPI-LED.GND 10.21,11.11 v11.81,9.51 | v78.73,6.16 v81.27,3.62 83.81,6.16 v87.62,6.16 | v74.92,2.35 v71.11,6.16 | v67.3,2.35 v64.76,4.89 | v60.95,2.35 59.68,2.35 v57.14,4.89 | v54.6,2.35 53.33,2.35 v50.79,4.89 | v48.25,2.35 46.98,2.35 v44.44,4.89 | v41.9,2.35 v38.09,2.35 | v29.2,2.35 v22.85,2.35 | v21.58,11.24 21.58,8.7 v22.85,7.43 v24.12,8.7 | 7.93,31.23 7.61,31.56 v7.61,32.83 | v12.69,40.45 11.64,40.45 11.53,40.56 11.31,40.56 v10.15,41.72 | v3.8,45.53 v3.8,49.34 | v6.34,53.15 v7.61,54.42 10.15,51.88 v17.77,51.88 | 22.11,35.21 22.85,34.47 v22.85,32.83 v24.12,34.1 25.5,34.1 v26.11,34.71
  Bottom 0.152: v22.85,30.29 v22.85,27.75 | v22.85,25.21 v22.85,22.67 | v63.49,15.05 v67.3,18.86 | v71.11,15.05 v74.92,18.86 | v78.73,15.05 v82.54,18.86 | v8.88,25.21 v7.61,23.94 | v3.8,15.05 5.07,13.78 v5.07,11.24 | v55.87,18.86 v53.33,16.32 | v50.79,18.86 v45.71,18.86 | v26.31,66.31 23.81,68.81 v23.81,69.91 | v21.21,75.81 25.01,72.01 v25.91,72.01 | I2C.GND 36.16,73.86 v35.11,72.81 | I2C.GND 36.16,80.06 35.71,80.51 v35.71,81.51 | v32.21,84.21 32.41,84.41 v36.61,84.41 | v43.41,83.51 43.41,74.61 v42.41,73.61 41.71,74.31 v39.61,74.31 | v39.51,82.61 41.11,81.01 41.11,80.01 40.51,79.41 v40.51,78.61 | v15.41,70.71 15.41,80.61 v15.51,80.71 | v41.71,37.81 41.71,35.91 v42.51,35.11 | v42.41,32.21 42.41,29.01 v42.71,28.71 | R3.1 44.75,15.4 44.75,16.26
  pour Bottom (rank 6): -16.49,100.51 97.71,100.51 97.71,-1.49 -16.49,-1.49
  pour Top (rank 6): -16.69,101.01 98.01,101.01 98.01,-2.89 -16.69,-2.89
LED0
  Bottom 0.152: R2.1 40.47,23.98 IC4.6
LED1
  Bottom 0.152: R4.1 41.47,24.06 IC4.7
N$2  (via drill 0.35)
  Top 0.152: v32.51,53.01 32.11,52.61 IC3.6
  Bottom 0.152: R4.2 40.34,36.78 38.71,38.41 38.71,51.41 36.51,53.61 33.11,53.61 v32.51,53.01
N$3
  Bottom 0.152: U4.29 12.43,37.31 13.21,37.31 13.51,37.61 13.51,39.31 14.76,40.56 C22.2
N$4  (via drill 0.35)
  Top 0.152: IC3.3 34.06,52.36 v34.01,52.41
  Bottom 0.152: v34.01,52.41 34.41,52.81 36.19,52.81 37.86,51.14 37.86,49.27 37.71,49.11 37.71,37.41 39.21,35.91 39.21,26.21 R2.2
N$5  (via drill 0.35)
  Top 0.152: U2.P$1 37.56,35.91 23.41,35.91 v22.31,37.01 | v9.36,47.67 9.11,47.41 9.11,45.41 9.14,45.44 U3.7
  Top 1.27: U2.P$1 U2.P$15
  Bottom 0.152: v22.31,37.01 22.31,37.61 17.41,42.51 13.41,42.51 10.91,45.01 10.91,47.12 10.36,47.67 v9.36,47.67
N$6
  Top 0.152: U1.2 14.21,54.16 R26.1
N$7
  Bottom 0.152: IC4.23 34.91,18.41 35.71,18.41 37.61,16.51 38.51,16.51 39.31,15.71 39.31,14.71 39.99,14.03 R3.2
N$8  (via drill 0.35)
  Top 0.152: U2.P$2 39.61,40.5 39.61,39.61 36.81,36.81 23.51,36.81 21.41,38.91 21.41,41.41 v20.51,42.31 | v8.41,48.71 7.87,48.17 U3.6
  Top 1.27: U2.P$2 U2.P$16
  Bottom 0.152: v20.51,42.31 19.31,43.51 13.71,43.51 11.71,45.51 11.71,47.41 10.31,48.81 8.51,48.81 v8.41,48.71
N$9
  Top 0.152: R15.1 6.63,56.64 U3.4
N$10
  Top 0.152: U2.P$25 22.71,47.41 20.91,49.21 20.91,51.61 20.31,52.21 19.91,52.21 19.21,52.91 LED1.SDI
  Top 1.27: U2.P$25 U2.P$11
N$11
  Top 0.152: U2.P$23 21.73,52.49 20.31,53.91 20.31,55.01 19.81,55.51 LED1.CKI
  Top 1.27: U2.P$23 U2.P$9
N$12  (via drill 0.35)
  Top 0.152: R16.1 30.31,59.6 30.31,59.01 v29.61,58.31 | v10.41,58.41 U3.1
  Bottom 0.152: v29.61,58.31 29.51,58.41 28.21,58.41 26.61,60.01 12.01,60.01 v10.41,58.41
N$13  (via drill 0.35)
  Top 0.152: LED1.SDO 16.71,53.81 16.71,52.41 16.01,51.71 8.21,51.71 v6.81,50.31
  Bottom 0.152: v6.81,50.31 6.81,41.61 5.92,40.72 5.92,20.02 7.03,18.91 14.81,18.91 16.21,17.51 SPI-LED.DI
N$14
  Bottom 0.152: U4.5 13.81,25.26 R13.1
N$15  (via drill 0.35)
  Top 0.152: LED1.CKO 17.01,55.51 16.11,54.61 16.11,53.31 15.71,52.91 7.41,52.91 v5.11,50.61 | v5.31,42.51 5.31,20.51 8.01,17.81 v13.71,17.81
  Bottom 0.152: v5.11,50.61 5.11,42.71 v5.31,42.51 | v13.71,17.81 14.21,17.31 SPI-LED.CI
N$16
  Bottom 0.152: U4.27 13.56,36.26 14.01,35.81 15.71,35.81 16.51,35.01 C19.2
N$17
  Bottom 0.152: U4.3 13.76,24.26 14.31,23.71 C13.2
N$18
  Bottom 0.152: U4.17 13.56,31.26 14.26,30.56 R31.2
N$21
  Bottom 0.152: C19.1 14.26,34.86 13.36,35.76 U4.26
N$22
  Bottom 0.152: U4.28 12.4,36.78 13.31,36.78 14.11,37.58 14.11,39.16 14.57,39.61 16.11,39.61 16.46,39.96 C22.1
N$23
  Top 0.152: R8.1 2.81,60.21 R24.1 4.01,59.71 4.01,58.11 Q3.G
N$24
  Top 0.152: R7.2 RCPWR.CATHODE
N$25
  Bottom 0.152: U4.4 14.91,24.76 C16.2
N$26  (via drill 0.35)
  Top 0.152: R26.2 14.21,58.16 13.86,58.51 v13.41,58.51 | v4.51,55.11 3.71,55.91 3.71,57.06 Q3.D
  Bottom 0.152: v13.41,58.51 11.71,56.81 7.71,56.81 6.01,55.11 v4.51,55.11
N$27  (via drill 0.35)
  Top 0.152: R27.2 8.01,60.91 v8.41,61.31 | v31.41,57.41 32.81,57.41 Q4.D
  Bottom 0.152: v8.41,61.31 9.11,60.61 29.01,60.61 31.41,58.21 v31.41,57.41
N$28
  Top 0.152: R27.1 8.01,56.74 U3.3
N$29  (via drill 0.35)
  Top 0.152: R29.2 12.06,58.96 v12.51,59.41 | v34.21,58.21 33.81,58.61 33.01,58.61 Q5.D
  Bottom 0.152: v12.51,59.41 26.01,59.41 29.91,55.51 32.51,55.51 34.21,57.21 v34.21,58.21
N$30
  Top 0.152: R29.1 12.06,54.96 11.31,54.21 9.51,54.21 9.14,54.57 U3.2
N$32  (via drill 0.35)
  Top 0.152: v19.21,38.11 19.11,38.01 18.11,38.01 16.11,36.01 9.91,36.01 8.61,34.71 8.61,32.91 9.51,32.01 11.61,32.01 14.21,29.41 16.91,29.41 v17.41,29.91
  Bottom 0.152: C12.2 R25.2 15.78,37.64 17.79,37.64 18.41,37.02 D1.ANODE 19.21,37.41 v19.21,38.11 | R31.1 16.76,30.56 v17.41,29.91
N$33
  Top 0.152: R34.2 36.91,57.56 36.91,60.01 36.06,60.86 R32.1 35.36,61.01 Q5.G
N$34
  Top 0.61: D4.1 20.9,44.87 U2.P$26
  Top 1.27: U2.P$26 U2.P$12
N$35
  Top 0.152: 37.88,62.53 37.81,62.61 37.81,63.47 U$1.15:TH_SINGNAL
  Top 0.254: R21.2 37.85,61.31 U$1.15:TH_SINGNAL
N$36
  Top 0.152: 27.73,63.46 U$1.11:ST_SIGNAL
  Top 0.254: R20.2 27.71,61.25 27.71,63.49 U$1.11:ST_SIGNAL
N$37
  Bottom 0.152: R36.2 20.51,31.61 R37.1 18.96,29.96 17.86,28.86 14.76,28.86 13.71,29.91 13.71,30.41 13.36,30.76 U4.16
N$38
  Top 0.152: R35.2 33.71,56.96 Q4.G 31.81,55.36 R33.1
N$41  (via drill 0.35)
  Top 0.152: v40.81,15.41 36.71,15.41 v36.11,14.81
  Bottom 0.152: R1.2 41.58,16.18 v40.81,15.41 | v36.11,14.81 35.86,14.56 C3.1 33.56,14.56 33.01,15.11 33.01,17.16 U$11.#3 32.72,18.06 IC4.25
N$50
  Bottom 0.152: R19.2 14.01,31.91 13.61,32.31 13.61,32.51 13.36,32.76 U4.20
NC5
  Top 1.27: U2.P$24 U2.P$10
PCH1
  Top 0.152: 17.51,63.49 U$1.7:SIGNAL1
  Top 0.254: R12.1 17.51,62.61 17.71,62.81 17.71,63.33 U$1.7:SIGNAL1
PCH2
  Top 0.152: R11.1 U$1.4:SIGNAL2
PCH3_328  (via drill 0.35)
  Top 0.152: U2.P$3 39.01,42.44 39.01,40.26 36.22,37.48 23.84,37.48 22.01,39.31 22.01,42.21 19.81,44.41 v18.71,44.41 | v14.21,44.61 R6.1 14.21,47.55 U1.3
  Top 1.27: U2.P$3 U2.P$17
  Bottom 0.152: v18.71,44.41 14.41,44.41 v14.21,44.61
PCH_1  (via drill 0.35)
  Top 0.152: U2.P$4 38.41,44.38 38.41,40.92 35.79,38.31 v34.11,38.31 R5.2 | IC3.1 35.36,52.16 35.61,52.41 36.61,52.41 36.91,52.11 v36.91,50.51
  Top 1.27: U2.P$4 U2.P$18
  Bottom 0.152: v36.91,50.51 36.91,48.91 31.91,43.91 31.91,40.51 v34.11,38.31
PCH_3
  Top 0.152: U$1.1:SIGNAL3 2.29,61.29 R8.2
RCH1  (via drill 0.35)
  Top 0.152: R20.1 27.73,55.08 v29.41,53.41 | v32.81,48.61 33.41,49.21 IC3.4
  Bottom 0.152: v29.41,53.41 31.31,51.51 31.31,49.31 32.01,48.61 v32.81,48.61
RCH2  (via drill 0.35)
  Top 0.152: R21.1 37.88,58.78 v37.61,58.51 | v32.91,54.41 32.41,54.41 31.51,53.51 31.51,51.26 IC3.7
  Bottom 0.152: v37.61,58.51 33.51,54.41 v32.91,54.41
RECV_CH1  (via drill 0.35)
  Top 0.152: R34.1 37.16,55.36 34.85,53.05 34.85,51.35 IC3.2 34.71,49.81 v34.61,49.71 | R12.2 17.51,58.71 v17.61,58.61
  Bottom 0.152: v17.61,58.61 25.11,58.61 28.31,55.41 28.31,49.21 30.81,46.71 33.21,46.71 34.61,48.11 v34.61,49.71
RECV_CH2  (via drill 0.35)
  Top 0.152: R35.1 35.41,54.86 32.76,52.21 IC3.5 32.76,49.96 32.31,49.51 29.81,49.51 28.91,50.41 28.91,52.51 27.61,53.81 v21.61,53.81 | R11.2 11.01,59.71 11.61,60.31 13.61,60.31 15.01,58.91 v15.01,58.71
  Bottom 0.152: v15.01,58.71 19.91,53.81 v21.61,53.81
SCL  (via drill 0.35)
  Top 0.152: v42.91,20.71 42.01,19.81 v36.31,19.81 | v28.01,6.61 32.01,2.61 v35.31,2.61
  Top 1.27: U2.P$6 U2.P$20
  Bottom 0.152: I2C.SCL 29.81,75.21 29.81,80.91 27.31,83.41 22.71,83.41 20.81,81.51 20.81,78.41 26.51,72.71 32.51,72.71 40.11,65.11 40.11,57.81 39.31,57.01 39.31,53.61 40.43,52.49 U2.P$6 42.71,51.22 42.71,37.31 43.91,36.11 43.91,21.71 v42.91,20.71 | v36.31,19.81 33.55,19.81 IC4.26 32.75,19.01 29.31,19.01 27.91,17.61 27.91,15.21 30.01,13.11 36.21,13.11 37.01,12.31 37.01,9.9 37.31,9.6 37.31,9.58 U$9.5 38.35,8.67 | 38.35,8.67 38.45,8.77 | v28.01,6.61 27.81,6.61 26.31,8.11 26.31,8.81 18.71,16.41 18.71,25.11 15.81,28.01 14.21,28.01 13.61,28.61 13.61,29.11 13.46,29.26 U4.13 | v35.31,2.61 37.55,4.85 R22.1 38.35,5.86 38.35,8.67
SDA  (via drill 0.35)
  Top 0.152: v42.61,22.21 41.41,21.01 v34.61,21.01 | v8.21,29.01 8.21,30.11 8.91,30.81 11.41,30.81 19.21,23.01 19.21,21.01 v23.61,16.61 | v33.71,3.91 33.71,6.57 U$9.3
  Top 1.27: U2.P$5 U2.P$19
  Bottom 0.152: I2C.SDA 32.61,75.31 32.61,79.81 27.71,84.71 22.01,84.71 19.61,82.31 19.61,76.01 24.81,70.81 31.01,70.81 38.81,63.01 38.81,58.31 38.41,57.91 38.41,52.91 41.37,49.95 U2.P$5 39.61,48.12 39.61,38.51 41.21,36.91 41.21,28.71 42.81,27.11 42.81,22.41 v42.61,22.21 | v34.61,21.01 33.83,21.01 IC4.27 32.33,19.51 27.21,19.51 24.31,16.61 v23.61,16.61 23.61,15.41 26.41,12.61 33.91,12.61 34.41,12.11 34.41,9.95 U$9.3 | U4.11 10.51,28.26 | 10.51,28.26 8.96,28.26 v8.21,29.01 | R23.1 34.11,3.91 v33.71,3.91 | U4.12 11.01,28.76 10.51,28.26
XIAO_5V
  Top 1.27: U2.P$28 U2.P$14
XIAO_RX
  Top 1.27: U2.P$22 U2.P$8
XIAO_TX
  Top 1.27: U2.P$7 U2.P$21

### Text on the board
tPlace: ch | 3 | ch | 2 | ch | 1 | ST | TH | VCC | VCC | VCC | VCC | VCC | SIGNAL | SIGNAL | SIGNAL | SIGNAL | SIGNAL | 1 | Rev 3.0.0
bPlace: Rev 3.0.0 | F-612-3-0-0-A-N-J-1-JLC
Document: Jetson Nano DevKit / B-01 | #612 JetRacer Rev 3.0.0 B / 2023/09/05